# Altium schematic sheet ADC.SchDoc: FMC_ADC
size 420 x 297 mm; Author: G.Kasprowicz; CompanyName: WUT ISE; DrawnBy: G.Kasprowicz; Organization: WUT ISE; Address1: PW ISE; Address2: Nowowiejska 15/19 00-665 Warsaw; Address3: gkasprow@gmail.com; DocumentNumber: 5; Revision: 2; SheetNumber: 5; SheetTotal: 12; ModifiedBy: -; CheckedDate: -; Title2: ADC; DivGrp: WUT ISE; Designer: G.Kasprowicz; ModifiedDate: -; ProjectName: Sensor Box
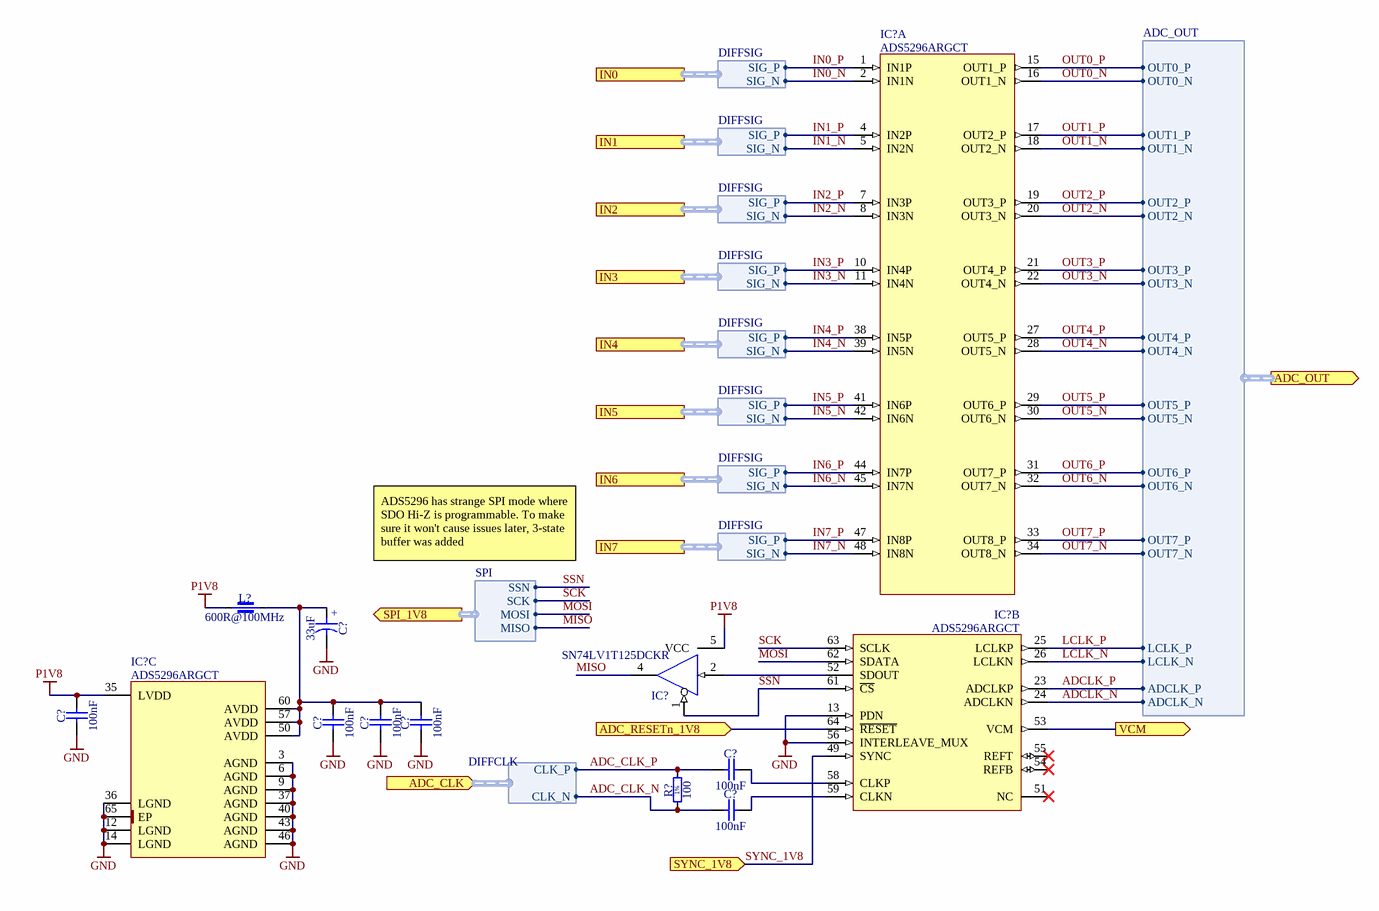
[diagram p0: ADC.SchDoc]

## Parts
(Parts that share a designator on the sheet are numbered #1, #2 ... from top to bottom, then left to right.)
C?#1  33uF  [CAPMP3216X180N]
C?#2  100nF  [CAPC0603X33N]
C?#3  100nF  [CAPC0603X33N]
C?#4  100nF  [CAPC0603X33N]
C?#5  100nF  [CAPC0603X33N]
C?#6  100nF  [CAPC0603X33N]
C?#7  100nF  [CAPC0603X33N]
IC?#1  ADS5296ARGCT  [QFN50P900X900X100-65N-S725]  (part A of 3)
IC?#2  ADS5296ARGCT  [QFN50P900X900X100-65N-S725]  (part B of 3)
IC?#3  ADS5296ARGCT  [QFN50P900X900X100-65N-S725]  (part C of 3)
IC?#4  SN74LV1T125DCKR  [SOT65P210X110-5N]
L?  600R@100MHz  [INDC1005X55N]
R?  100  [RESC0603X28N]

## Ports
ADC_CLK (in, harness DIFFCLK), ADC_OUT (out, harness ADC_OUT), ADC_RESETn_1V8 (in), IN0 (harness DIFFSIG), IN1 (harness DIFFSIG), IN2 (harness DIFFSIG), IN3 (harness DIFFSIG), IN4 (harness DIFFSIG), IN5 (harness DIFFSIG), IN6 (harness DIFFSIG), IN7 (harness DIFFSIG), SPI_1V8 (out, harness SPI), SYNC_1V8 (in), VCM (out)

## Harnesses
ADC_OUT: LCLK_P, LCLK_N, ADCLK_P, ADCLK_N, OUT1_N, OUT2_N, OUT3_N, OUT4_N, OUT5_N, OUT1_P, OUT2_P, OUT3_P, OUT4_P, OUT5_P, OUT6_P, OUT6_N, OUT7_P, OUT7_N, OUT0_P, OUT0_N
SPI: MISO, MOSI, SCK, SSN
DIFFCLK: CLK_P, CLK_N
DIFFSIG: SIG_P, SIG_N

## Nets
GND: C?#1.2 C?#2.1 C?#3.1 C?#4.1 C?#5.1 IC?#2.13(PDN) IC?#2.56(INTERLEAVE_MUX) IC?#3.3(AGND) IC?#3.6(AGND) IC?#3.9(AGND) IC?#3.12(LGND) IC?#3.14(LGND) IC?#3.36(LGND) IC?#3.37(AGND) IC?#3.40(AGND) IC?#3.43(AGND) IC?#3.46(AGND) IC?#3.65(EP) IC?#4.3(GND)
P1V8: C?#2.2 IC?#3.35(LVDD) IC?#4.5(VCC) L?.1
ADC_CLK_N: C?#7.1 R?.1 ; port ADC_CLK.CLK_N
ADC_CLK_P: C?#6.1 R?.2 ; port ADC_CLK.CLK_P
ADC_RESETn_1V8: IC?#2.64(~{RESET}) ; port ADC_RESETn_1V8
ADCLK_N: IC?#2.24(ADCLKN) ; port ADC_OUT.ADCLK_N
ADCLK_P: IC?#2.23(ADCLKP) ; port ADC_OUT.ADCLK_P
IN0_N: IC?#1.2(IN1N) ; port IN0.SIG_N
IN0_P: IC?#1.1(IN1P) ; port IN0.SIG_P
IN1_N: IC?#1.5(IN2N) ; port IN1.SIG_N
IN1_P: IC?#1.4(IN2P) ; port IN1.SIG_P
IN2_N: IC?#1.8(IN3N) ; port IN2.SIG_N
IN2_P: IC?#1.7(IN3P) ; port IN2.SIG_P
IN3_N: IC?#1.11(IN4N) ; port IN3.SIG_N
IN3_P: IC?#1.10(IN4P) ; port IN3.SIG_P
IN4_N: IC?#1.39(IN5N) ; port IN4.SIG_N
IN4_P: IC?#1.38(IN5P) ; port IN4.SIG_P
IN5_N: IC?#1.42(IN6N) ; port IN5.SIG_N
IN5_P: IC?#1.41(IN6P) ; port IN5.SIG_P
IN6_N: IC?#1.45(IN7N) ; port IN6.SIG_N
IN6_P: IC?#1.44(IN7P) ; port IN6.SIG_P
IN7_N: IC?#1.48(IN8N) ; port IN7.SIG_N
IN7_P: IC?#1.47(IN8P) ; port IN7.SIG_P
LCLK_N: IC?#2.26(LCLKN) ; port ADC_OUT.LCLK_N
LCLK_P: IC?#2.25(LCLKP) ; port ADC_OUT.LCLK_P
MISO: IC?#4.4(OUT) ; port SPI_1V8.MISO
MOSI: IC?#2.62(SDATA) ; port SPI_1V8.MOSI
OUT0_N: IC?#1.16(OUT1_N) ; port ADC_OUT.OUT0_N
OUT0_P: IC?#1.15(OUT1_P) ; port ADC_OUT.OUT0_P
OUT1_N: IC?#1.18(OUT2_N) ; port ADC_OUT.OUT1_N
OUT1_P: IC?#1.17(OUT2_P) ; port ADC_OUT.OUT1_P
OUT2_N: IC?#1.20(OUT3_N) ; port ADC_OUT.OUT2_N
OUT2_P: IC?#1.19(OUT3_P) ; port ADC_OUT.OUT2_P
OUT3_N: IC?#1.22(OUT4_N) ; port ADC_OUT.OUT3_N
OUT3_P: IC?#1.21(OUT4_P) ; port ADC_OUT.OUT3_P
OUT4_N: IC?#1.28(OUT5_N) ; port ADC_OUT.OUT4_N
OUT4_P: IC?#1.27(OUT5_P) ; port ADC_OUT.OUT4_P
OUT5_N: IC?#1.30(OUT6_N) ; port ADC_OUT.OUT5_N
OUT5_P: IC?#1.29(OUT6_P) ; port ADC_OUT.OUT5_P
OUT6_N: IC?#1.32(OUT7_N) ; port ADC_OUT.OUT6_N
OUT6_P: IC?#1.31(OUT7_P) ; port ADC_OUT.OUT6_P
OUT7_N: IC?#1.34(OUT8_N) ; port ADC_OUT.OUT7_N
OUT7_P: IC?#1.33(OUT8_P) ; port ADC_OUT.OUT7_P
SCK: IC?#2.63(SCLK) ; port SPI_1V8.SCK
SSN: IC?#2.61(~{CS}) IC?#4.1(~{G}) ; port SPI_1V8.SSN
SYNC_1V8: IC?#2.49(SYNC) ; port SYNC_1V8
VCM: IC?#2.53(VCM) ; port VCM
NetC?#1_1: C?#1.1 C?#3.2 C?#4.2 C?#5.2 IC?#3.50(AVDD) IC?#3.57(AVDD) IC?#3.60(AVDD) L?.2
NetC?#6_2: C?#6.2 IC?#2.58(CLKP)
NetC?#7_2: C?#7.2 IC?#2.59(CLKN)
NetIC?#2_52: IC?#2.52(SDOUT) IC?#4.2(IN)

Not connected (* = marked no-connect by the designer): IC?#2 51(NC)* 54(REFB)* 55(REFT)*

## Notes on the sheet
- ADS5296 has strange SPI mode where SDO Hi-Z is programmable. To make sure it won't cause issues later, 3-state buffer was added
- Project/Equipment
- Document
- Designer
- Drawn by
- Check.by
- Copyright WUT ISE 2018.
  This documentation describes Open Hardware and is licensed under the CERN OHL v.1.1. You may redistribute and modify this documentation under the terms of the CERN OHL v.1.1. (http://ohwr.org/CERNOHL). This documentation is distributed WITHOUT ANY EXPRESS OR IMPLIED WARRANTY, INCLUDING OF MERCHANTABILITY, SATISFACTORY QUALITY AND FITNESS FOR A PARTICULAR PURPOSE. Please see the CERN OHL v.1.1 for applicable conditions.
- Contact
- File
- Last Mod.
- Print Date
- Sheet
- Size
- A3
- of
- Rev
- (in symbol CTE3216-18_33UF_4V_10%) +
- (in symbol R0201_100R_1%_0.05W_200PPM) 1%

## Library data of the parts
C?#1 = CTE3216-18_33UF_4V_10%: Polarised capacitor; Part Description: Solid Tantalum Chip Capacitor; Manufacturer: GENERIC; Manufacturer1 Part Number: TAJA336K004R; Voltage: 4V; Tolerance: ±10%; Part Number: CTE3216-18_33UF_4V_10%; Component Kind: Standard; Component Type: Standard; Pin Count: 2; Value: 33uF; Status: Preferred; Manufacturer Part Number: CTE3216-18_33UF_4V_10%; Case: A; Mounted: Yes; Socket: No; SMD: Yes; Sense: No; Manufacturer1 Example: AVX; Manufacturer1 ComponentHeight: 1.8mm; HelpURL: \\cern.ch\dfs\Applications\Altium\Datasheets\CTE_AVX_TAJ.pdf; Author: CERN DEM JLC; CreateDate: 03.12.2007; LatestRevisionDate: 03.12.2007
C?#2-C?#7 = CC0201_100NF_6.3V_10%_X5R: Non-polarised capacitor; Part Description: SMD Multilayer Chip Ceramic Capacitor; Manufacturer: GENERIC; Manufacturer1 Part Number: 02016D104KAT2A; Voltage: 6.3V; TC: X5R; Tolerance: ±10%; Part Number: CC0201_100NF_6.3V_10%_X5R; Component Kind: Standard; Component Type: Standard; Pin Count: 2; Value: 100nF; Status: Not Recommended; Manufacturer Part Number: CC0201_100NF_6.3V_10%_X5R; Case: 0201; Mounted: Yes; Socket: No; SMD: Yes; Sense: No; Manufacturer1 Example: AVX; Manufacturer1 ComponentHeight: 0.33mm; HelpURL: \\cern.ch\dfs\Applications\Altium\Datasheets\CC0201_X5R_AVX.pdf; Author: CERN DEM JLC; CreateDate: 03.12.2007; LatestRevisionDate: 03.12.2007
IC?#1-IC?#3 = ADC_ADS5296A: 10-Bit,200-MSPS,4-Channel and 12-Bit,80-MSPS,8-ChannelAnalog-to-DigitalConverter, -40 to 85 degC, 64-pin QFP (PFP8), Green (RoHS & no Sb/Br); Manufacturer: TEXAS INSTRUMENTS; PressFit: No; Part Number: ADS5296ARGCT; Component Kind: Standard; Component Type: Standard; Device: ADS5296ARGCT; PackageDescription: QFN, 0.50mm Pitch, Square; 64 Pin, 9.00mm L X 9.00mm W X 1.00mm H Body (7.25 X 7.25mm Thermal Tab), IPC Medium Density; Part Description: 10-Bit,200-MSPS,4-Channeland 12-Bit,80-MSPS,8-ChannelAnalog-to-DigitalConverter; Manufacturer Part Number: ADS5296ARGCT; Pin Count: 65; Case: QFP80; Mounted: Yes; Socket: No; SMD: Yes; Sense: No; Bonding: No; ComponentHeight: 1.2mm; Author: GK; HelpURL: \\cern.ch\dfs\Applications\Altium\Datasheets\ADS5292IPFP.pdf; CreateDate: 22.01.2015; LatestRevisionDate: 22.01.2015
IC?#4 = SN74LV1T125DCKR: Single Power Supply Single Buffer Gate with 3-State Output CMOS Logic Level Shifter; Manufacturer: TEXAS INSTRUMENTS; PressFit: No; Bonding: No; Part Number: SN74LV1T125DCKR; Component Kind: Standard; Component Type: Standard; Device: SN74LV1T125DCKR; PackageDescription: SOT353, SC70-5, SOT, 0.65mm Pitch, 5 pin, 1.25mm W X 2.00mm L X 1.10mm H, IPC Medium Density; Part Description: Single Power Supply Single Buffer Gate with 3-State Output CMOS Logic Level Shifter; Manufacturer Part Number: SN74LV1T125DCKR; Pin Count: 5; Case: SOT353; Mounted: Yes; Socket: No; SMD: Yes; Sense: No; ComponentHeight: 1.1mm; Author: CERN DEM JLC; HelpURL: \\cern.ch\dfs\Applications\Altium\Datasheets\SN74LV1T125DCKR.pdf; CreateDate: 13.06.2018; LatestRevisionDate: 13.06.2018
L? = IND0402_MURATA_BLM15HD601SN1: Part Description: SMD EMIFIL Suppression Chip Ferrite Bead; Manufacturer: MURATA; Manufacturer Part Number: BLM15HD601SN1D; Power: 300mA; Resistance: 0.85R; Tolerance: ±25%; Part Number: IND0402_MURATA_BLM15HD601SN1; Component Kind: Standard; Component Type: Standard; Pin Count: 2; Value: 600R@100MHz; Status: None; Case: 0402; Mounted: Yes; Socket: No; SMD: Yes; Sense: No; ComponentHeight: 0.55mm; HelpURL: \\cern.ch\dfs\Applications\Altium\Datasheets\IND0402_MURATA_BLM15H.pdf; Author: CERN DEM JLC; CreateDate: 28.02.2012; LatestRevisionDate: 25.10.2018
R? = R0201_100R_1%_0.05W_200PPM: Resistor - 1%; Part Description: Thick Film Chip Resistor; Manufacturer: GENERIC; Manufacturer1 Part Number: CRCW0201100RFNED; Power: 0.05W; TC: ±200ppm/°C; PressFit: No; Part Number: R0201_100R_1%_0.05W_200PPM; Component Kind: Standard; Component Type: Standard; Pin Count: 2; Value: 100; Status: Not Recommended; Tolerance: ±1%; Manufacturer Part Number: R0201_100R_1%_0.05W_200PPM; Case: 0201; Mounted: Yes; Sense: No; Socket: No; SMD: Yes; Manufacturer1 Example: VISHAY; Manufacturer1 ComponentHeight: 0.27mm; HelpURL: \\cern.ch\dfs\Applications\Altium\Datasheets\R0201_VISHAY_CRCW0201 e3.pdf; Author: CERN DEM JLC; CreateDate: 13.11.2014; LatestRevisionDate: 13.11.2014